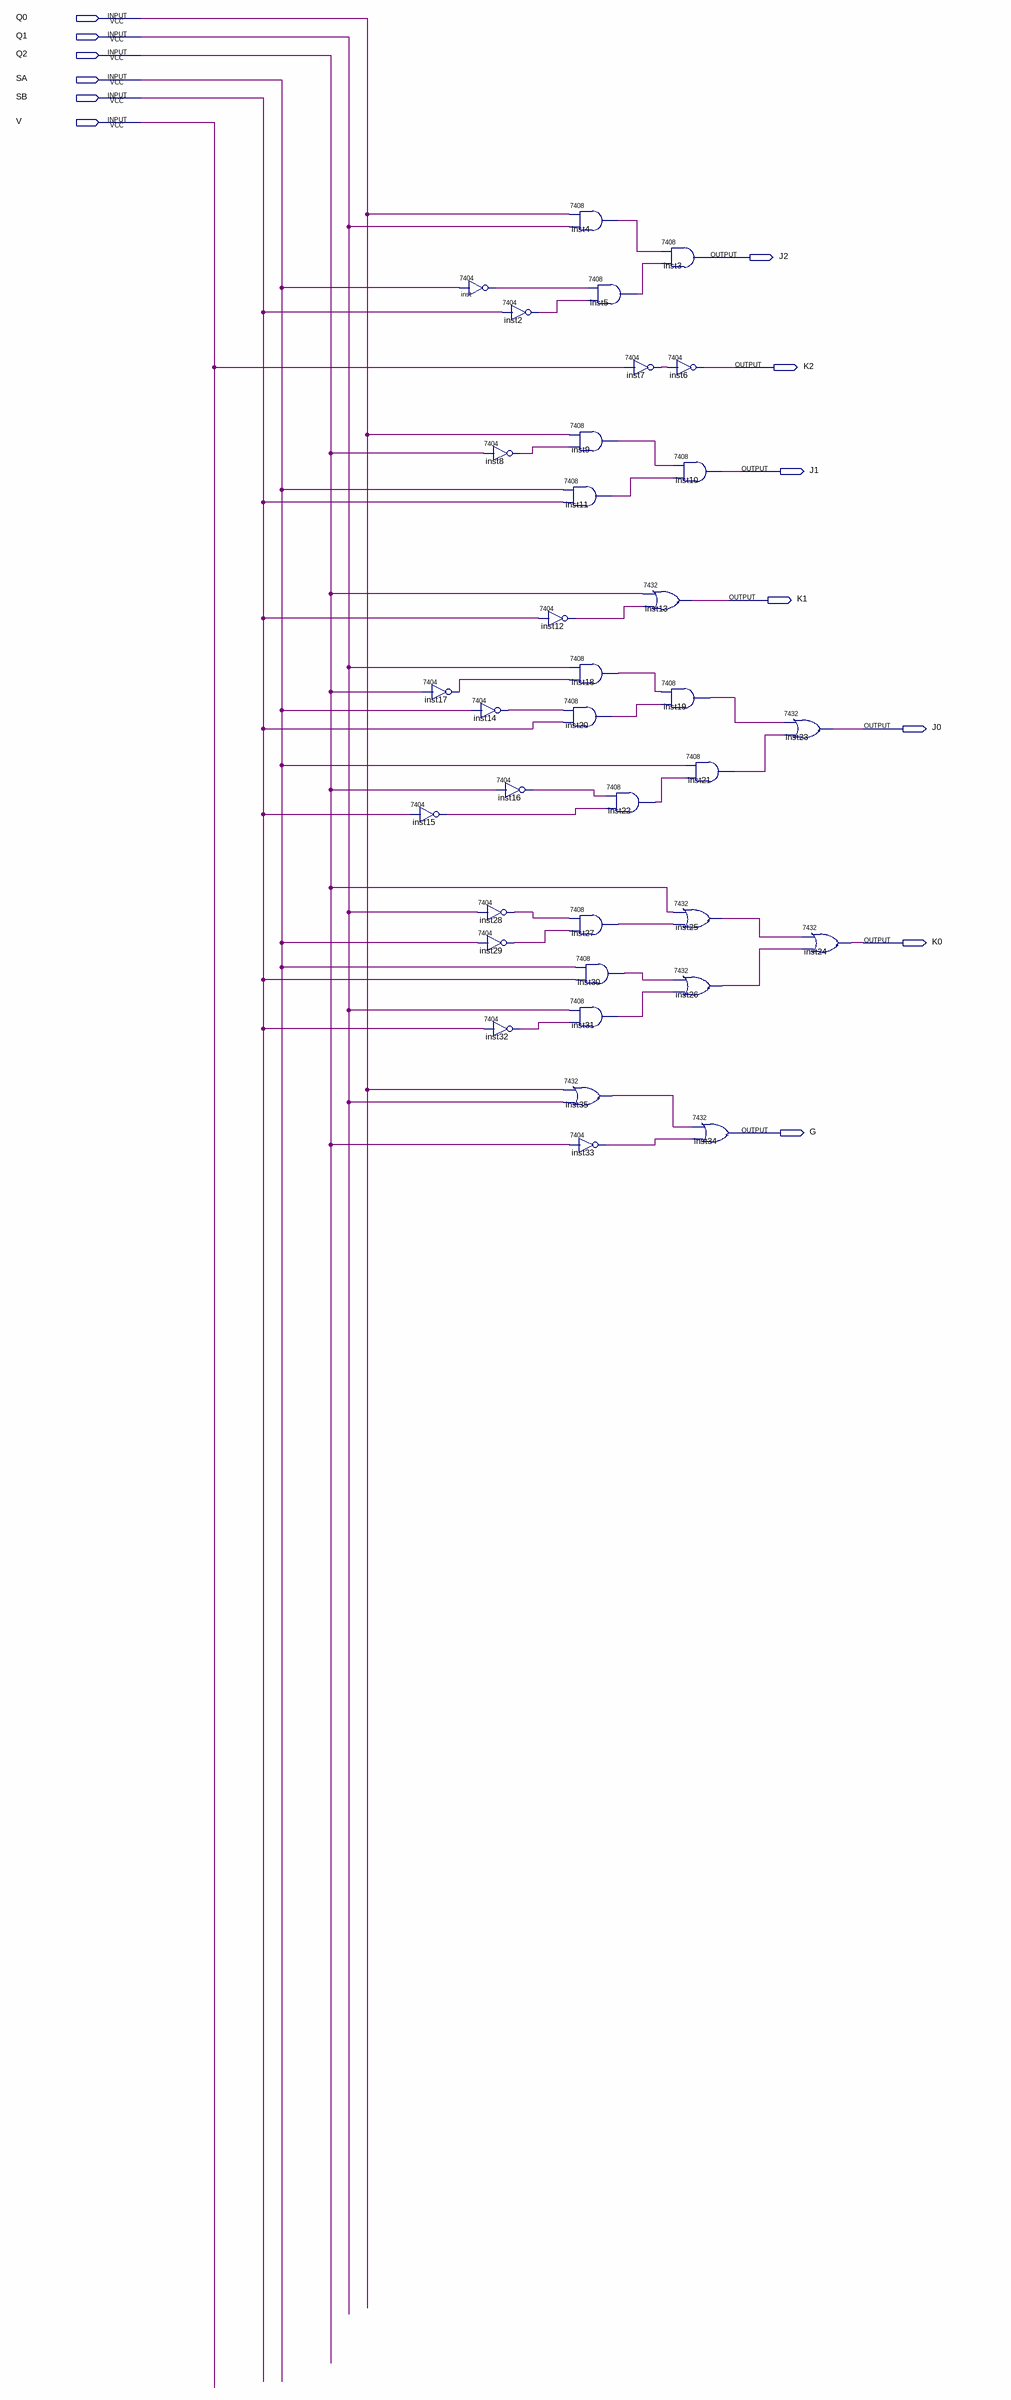
[diagram p0: schematic sheet]
// Quartus schematic controle_giro.bdf as structural Verilog: 35 symbols, 13 pins
module controle_giro (
  input  Q0,
  input  Q1,
  input  Q2,
  input  SA,
  input  SB,
  input  V,
  output J2,
  output K2,
  output J1,
  output K1,
  output J0,
  output K0,
  output G
);

  wire inst2_1, inst4_1, inst5_1, inst7_1, inst8_1, inst9_1, inst11_1, inst12_1, inst14_1, inst15_1,
       inst16_1, inst17_1, inst18_1, inst19_1, inst20_1, inst21_1, inst22_1, inst25_1, inst26_1, inst27_1,
       inst28_1, inst29_1, inst30_1, inst31_1, inst32_1, inst33_1, inst35_1, inst_1;

  \7404  inst15 (.\2 (SB), .\1 (inst15_1));
  \7404  inst (.\2 (SA), .\1 (inst_1));
  \7404  inst17 (.\2 (Q2), .\1 (inst17_1));
  \7404  inst2 (.\2 (SB), .\1 (inst2_1));
  \7404  inst8 (.\2 (Q2), .\1 (inst8_1));
  \7404  inst14 (.\2 (SA), .\1 (inst14_1));
  \7404  inst16 (.\2 (Q2), .\1 (inst16_1));
  \7404  inst28 (.\2 (Q1), .\1 (inst28_1));
  \7404  inst29 (.\2 (SA), .\1 (inst29_1));
  \7404  inst32 (.\2 (SB), .\1 (inst32_1));
  \7408  inst11 (.\3 (SB), .\2 (SA), .\1 (inst11_1));
  \7404  inst12 (.\2 (SB), .\1 (inst12_1));
  \7408  inst20 (.\3 (SB), .\2 (inst14_1), .\1 (inst20_1));
  \7432  inst35 (.\2 (Q0), .\3 (Q1), .\1 (inst35_1));
  \7408  inst4 (.\3 (Q1), .\2 (Q0), .\1 (inst4_1));
  \7408  inst5 (.\3 (inst2_1), .\2 (inst_1), .\1 (inst5_1));
  \7408  inst9 (.\3 (inst8_1), .\2 (Q0), .\1 (inst9_1));
  \7408  inst18 (.\3 (inst17_1), .\2 (Q1), .\1 (inst18_1));
  \7408  inst22 (.\3 (inst15_1), .\2 (inst16_1), .\1 (inst22_1));
  \7408  inst27 (.\3 (inst29_1), .\2 (inst28_1), .\1 (inst27_1));
  \7408  inst30 (.\3 (SB), .\2 (SA), .\1 (inst30_1));
  \7408  inst31 (.\3 (inst32_1), .\2 (Q1), .\1 (inst31_1));
  \7404  inst33 (.\2 (Q2), .\1 (inst33_1));
  \7408  inst3 (.\3 (inst5_1), .\2 (inst4_1), .\1 (J2));
  \7404  inst7 (.\2 (V), .\1 (inst7_1));
  \7432  inst13 (.\2 (Q2), .\3 (inst12_1), .\1 (K1));
  \7408  inst19 (.\3 (inst20_1), .\2 (inst18_1), .\1 (inst19_1));
  \7404  inst6 (.\2 (inst7_1), .\1 (K2));
  \7408  inst10 (.\3 (inst11_1), .\2 (inst9_1), .\1 (J1));
  \7408  inst21 (.\3 (inst22_1), .\2 (SA), .\1 (inst21_1));
  \7432  inst25 (.\2 (Q2), .\3 (inst27_1), .\1 (inst25_1));
  \7432  inst26 (.\2 (inst30_1), .\3 (inst31_1), .\1 (inst26_1));
  \7432  inst34 (.\2 (inst35_1), .\3 (inst33_1), .\1 (G));
  \7432  inst23 (.\2 (inst19_1), .\3 (inst21_1), .\1 (J0));
  \7432  inst24 (.\2 (inst25_1), .\3 (inst26_1), .\1 (K0));
endmodule
